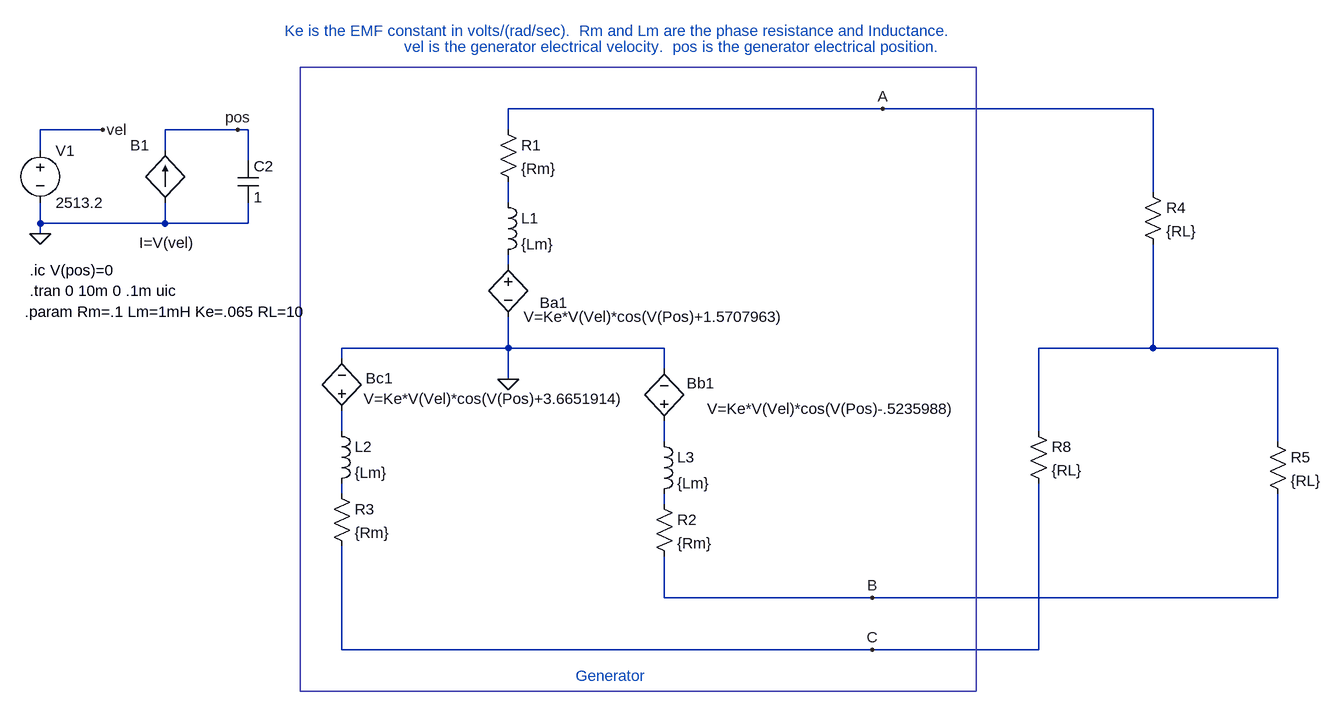
[diagram p0: schematic PM generator.asc]
PM generator.asc, the LTspice schematic file:
Version 4
SHEET 1 1480 724
WIRE 576 -208 0 -208
WIRE 992 -208 576 -208
WIRE -624 -176 -720 -176
WIRE -416 -176 -528 -176
WIRE -400 -176 -416 -176
WIRE 0 -176 0 -208
WIRE -720 -144 -720 -176
WIRE -528 -144 -528 -176
WIRE -400 -128 -400 -176
WIRE 992 -80 992 -208
WIRE 0 -64 0 -96
WIRE -720 -32 -720 -64
WIRE -528 -32 -528 -64
WIRE -528 -32 -720 -32
WIRE -400 -32 -400 -64
WIRE -400 -32 -528 -32
WIRE -720 -16 -720 -32
WIRE 0 32 0 16
WIRE 0 160 0 112
WIRE 0 160 -256 160
WIRE 240 160 0 160
WIRE 992 160 992 0
WIRE 992 160 816 160
WIRE 1184 160 992 160
WIRE -256 176 -256 160
WIRE 240 192 240 160
WIRE 0 208 0 160
WIRE -256 288 -256 256
WIRE 816 288 816 160
WIRE 240 304 240 272
WIRE 1184 304 1184 160
WIRE -256 384 -256 368
WIRE 240 400 240 384
WIRE 240 544 240 480
WIRE 560 544 240 544
WIRE 1184 544 1184 384
WIRE 1184 544 560 544
WIRE -256 624 -256 464
WIRE 560 624 -256 624
WIRE 816 624 816 368
WIRE 816 624 560 624
FLAG 0 208 0
FLAG -720 -16 0
FLAG -624 -176 vel
FLAG -416 -176 pos
FLAG 576 -208 A
FLAG 560 544 B
FLAG 560 624 C
SYMBOL ind -16 -80 R0
SYMATTR InstName L1
SYMATTR Value {Lm}
SYMBOL ind -272 272 R0
SYMATTR InstName L2
SYMATTR Value {Lm}
SYMBOL ind 224 288 R0
SYMATTR InstName L3
SYMATTR Value {Lm}
SYMBOL res -16 -192 R0
SYMATTR InstName R1
SYMATTR Value {Rm}
SYMBOL res 224 384 R0
SYMATTR InstName R2
SYMATTR Value {Rm}
SYMBOL res -272 368 R0
SYMATTR InstName R3
SYMATTR Value {Rm}
SYMBOL bv 0 16 R0
WINDOW 0 48 74 Left 0
SYMATTR InstName Ba1
SYMATTR Value V=Ke*V(Vel)*cos(V(Pos)+1.5707963)
SYMATTR Value2 tripdv=100
SYMBOL bv -256 272 R180
WINDOW 0 -78 66 Left 0
WINDOW 3 -434 34 Left 0
SYMATTR InstName Bc1
SYMATTR Value V=Ke*V(Vel)*cos(V(Pos)+3.6651914)
SYMATTR Value2 tripdv=100
SYMBOL bv 240 288 R180
WINDOW 0 -77 74 Left 0
WINDOW 3 -447 35 Left 0
SYMATTR InstName Bb1
SYMATTR Value V=Ke*V(Vel)*cos(V(Pos)-.5235988)
SYMATTR Value2 tripdv=100
SYMBOL voltage -720 -160 R0
WINDOW 123 0 0 Left 0
WINDOW 39 0 0 Left 0
SYMATTR InstName V1
SYMATTR Value 2513.2
SYMBOL bi -528 -64 R180
WINDOW 0 24 88 Left 0
WINDOW 3 -44 -62 Left 0
SYMATTR InstName B1
SYMATTR Value I=V(vel)
SYMBOL cap -416 -128 R0
SYMATTR InstName C2
SYMATTR Value 1
SYMBOL res 976 -96 R0
SYMATTR InstName R4
SYMATTR Value {RL}
SYMBOL res 1168 288 R0
SYMATTR InstName R5
SYMATTR Value {RL}
SYMBOL res 800 272 R0
SYMATTR InstName R8
SYMATTR Value {RL}
TEXT -744 104 Left 0 !.param Rm=.1 Lm=1mH Ke=.065 RL=10
TEXT -736 72 Left 0 !.tran 0 10m 0 .1m uic
TEXT -736 40 Left 0 !.ic V(pos)=0
TEXT 104 664 Left 0 ;Generator
TEXT -344 -328 Left 0 ;Ke is the EMF constant in volts/(rad/sec).  Rm and Lm are the phase resistance and Inductance.
TEXT -160 -304 Left 0 ;vel is the generator electrical velocity.  pos is the generator electrical position.
RECTANGLE Normal -320 688 720 -272

The netlist it stands for:
* PM generator.asc
L1 N001 N002 {Lm}
L2 N004 N006 {Lm}
L3 N005 N007 {Lm}
R1 A N001 {Rm}
R2 N007 B {Rm}
R3 N006 C {Rm}
Ba1 N002 0 V=Ke*V(Vel)*cos(V(Pos)+1.5707963) tripdv=100
Bc1 N004 0 V=Ke*V(Vel)*cos(V(Pos)+3.6651914) tripdv=100
Bb1 N005 0 V=Ke*V(Vel)*cos(V(Pos)-.5235988) tripdv=100
V1 vel 0 2513.2
B1 0 pos I=V(vel)
C2 pos 0 1
R4 A N003 {RL}
R5 N003 B {RL}
R8 N003 C {RL}
.param Rm=.1 Lm=1mH Ke=.065 RL=10
.tran 0 10m 0 .1m uic
.ic V(pos)=0
* Generator
* Ke is the EMF constant in volts/(rad/sec).  Rm and Lm are the phase resistance and Inductance.
* vel is the generator electrical velocity.  pos is the generator electrical position.
.backanno
.end